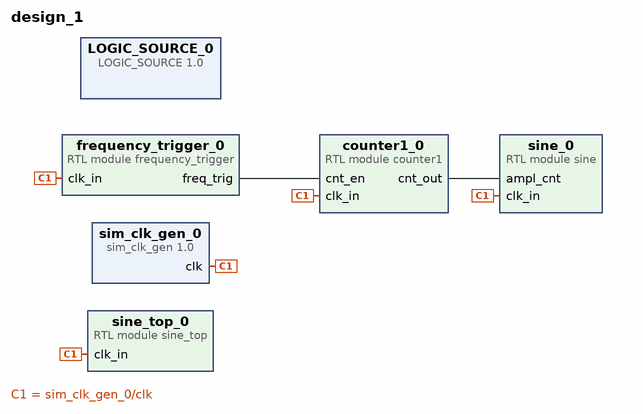
[diagram p0: block diagram of the top level]
# Vivado block design design_1, xc7z020clg484-1, Vivado 2018.3
create_bd_design design_1

create_bd_cell -type module -reference sine sine_0
create_bd_cell -type module -reference frequency_trigger frequency_trigger_0
create_bd_cell -type module -reference sine_top sine_top_0
create_bd_cell -type module -reference counter1 counter1_0
create_bd_cell -type ip -vlnv xilinx.com:ip:sim_clk_gen:1.0 sim_clk_gen_0
create_bd_cell -type ip -vlnv xilinx.com:user:LOGIC_SOURCE:1.0 LOGIC_SOURCE_0

# ---- connections ----

connect_bd_net [get_bd_pins frequency_trigger_0/freq_trig] [get_bd_pins counter1_0/cnt_en]
connect_bd_net [get_bd_pins sim_clk_gen_0/clk] \
  [get_bd_pins frequency_trigger_0/clk_in] [get_bd_pins sine_top_0/clk_in] [get_bd_pins sine_0/clk_in] \
  [get_bd_pins counter1_0/clk_in]
connect_bd_net [get_bd_pins counter1_0/cnt_out] [get_bd_pins sine_0/ampl_cnt]

validate_bd_design
save_bd_design
